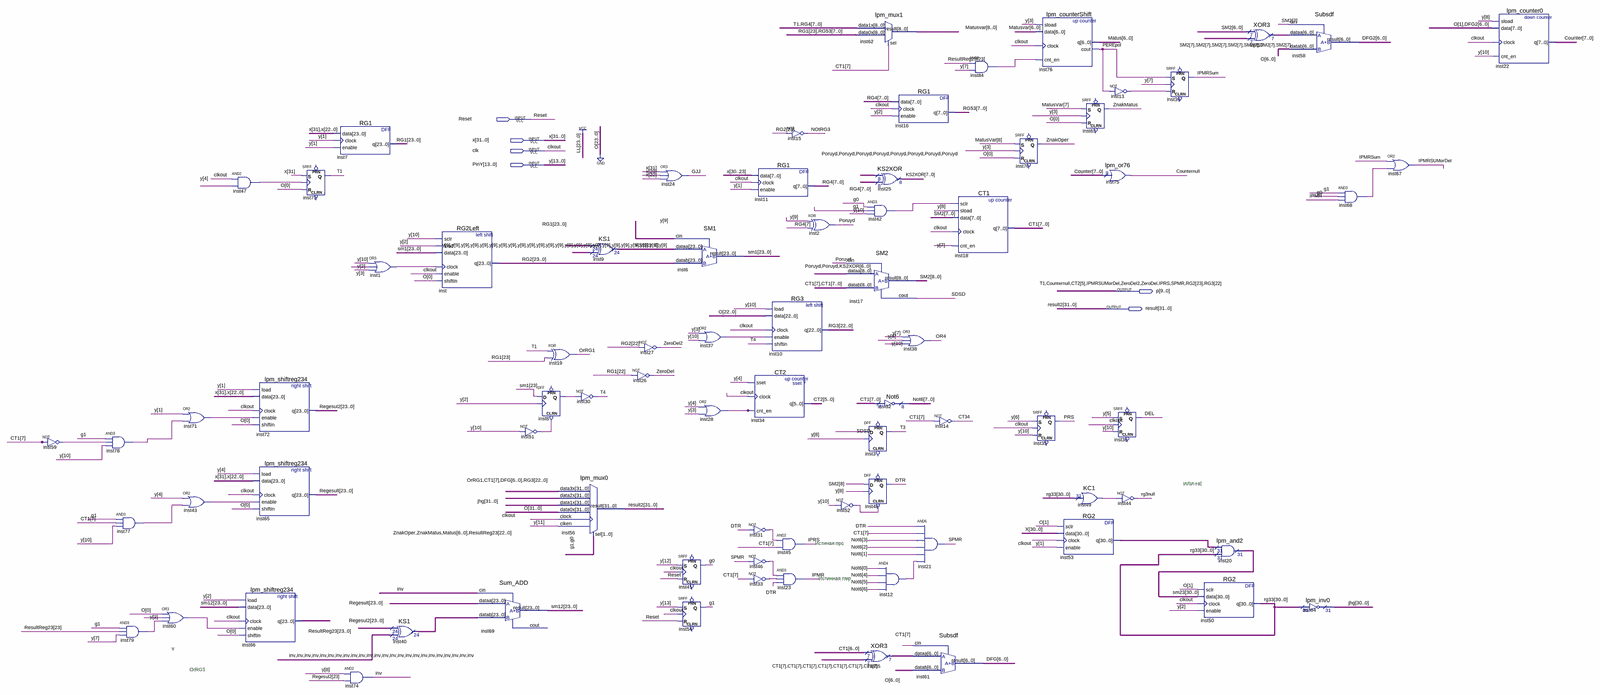
[diagram p0: schematic sheet, whole]
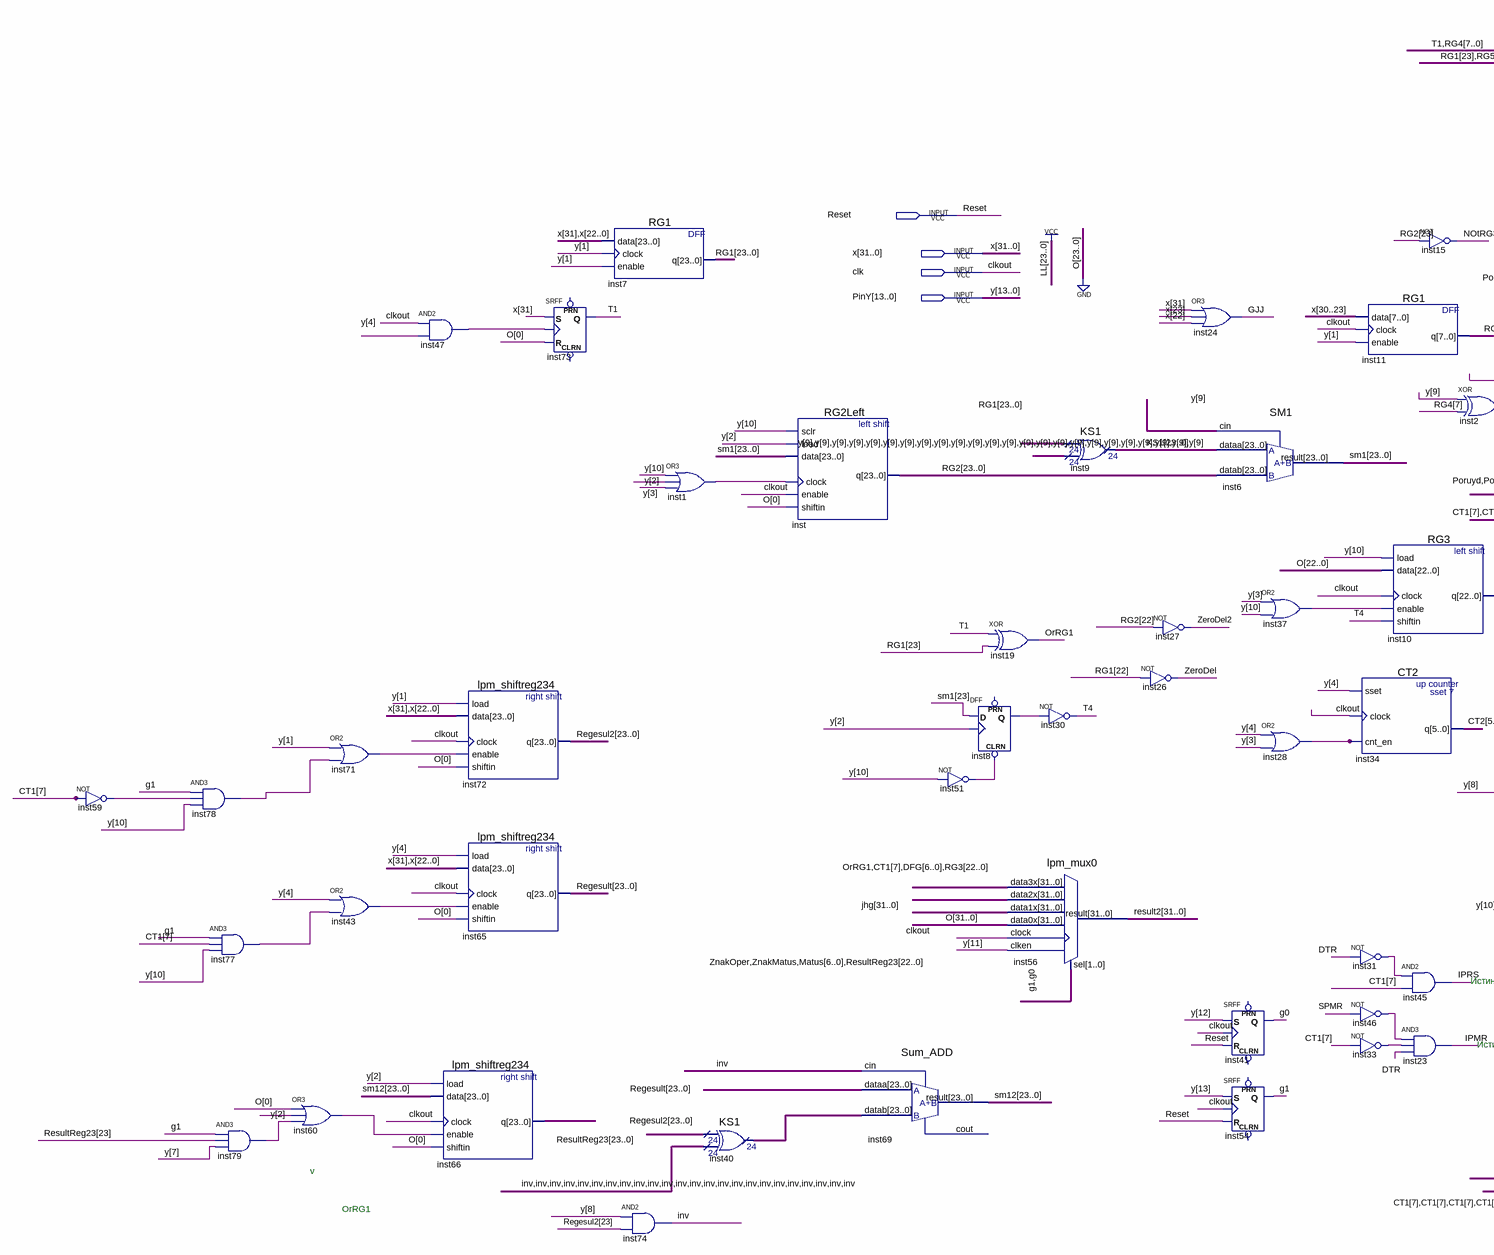
[diagram p1: schematic sheet, left part]
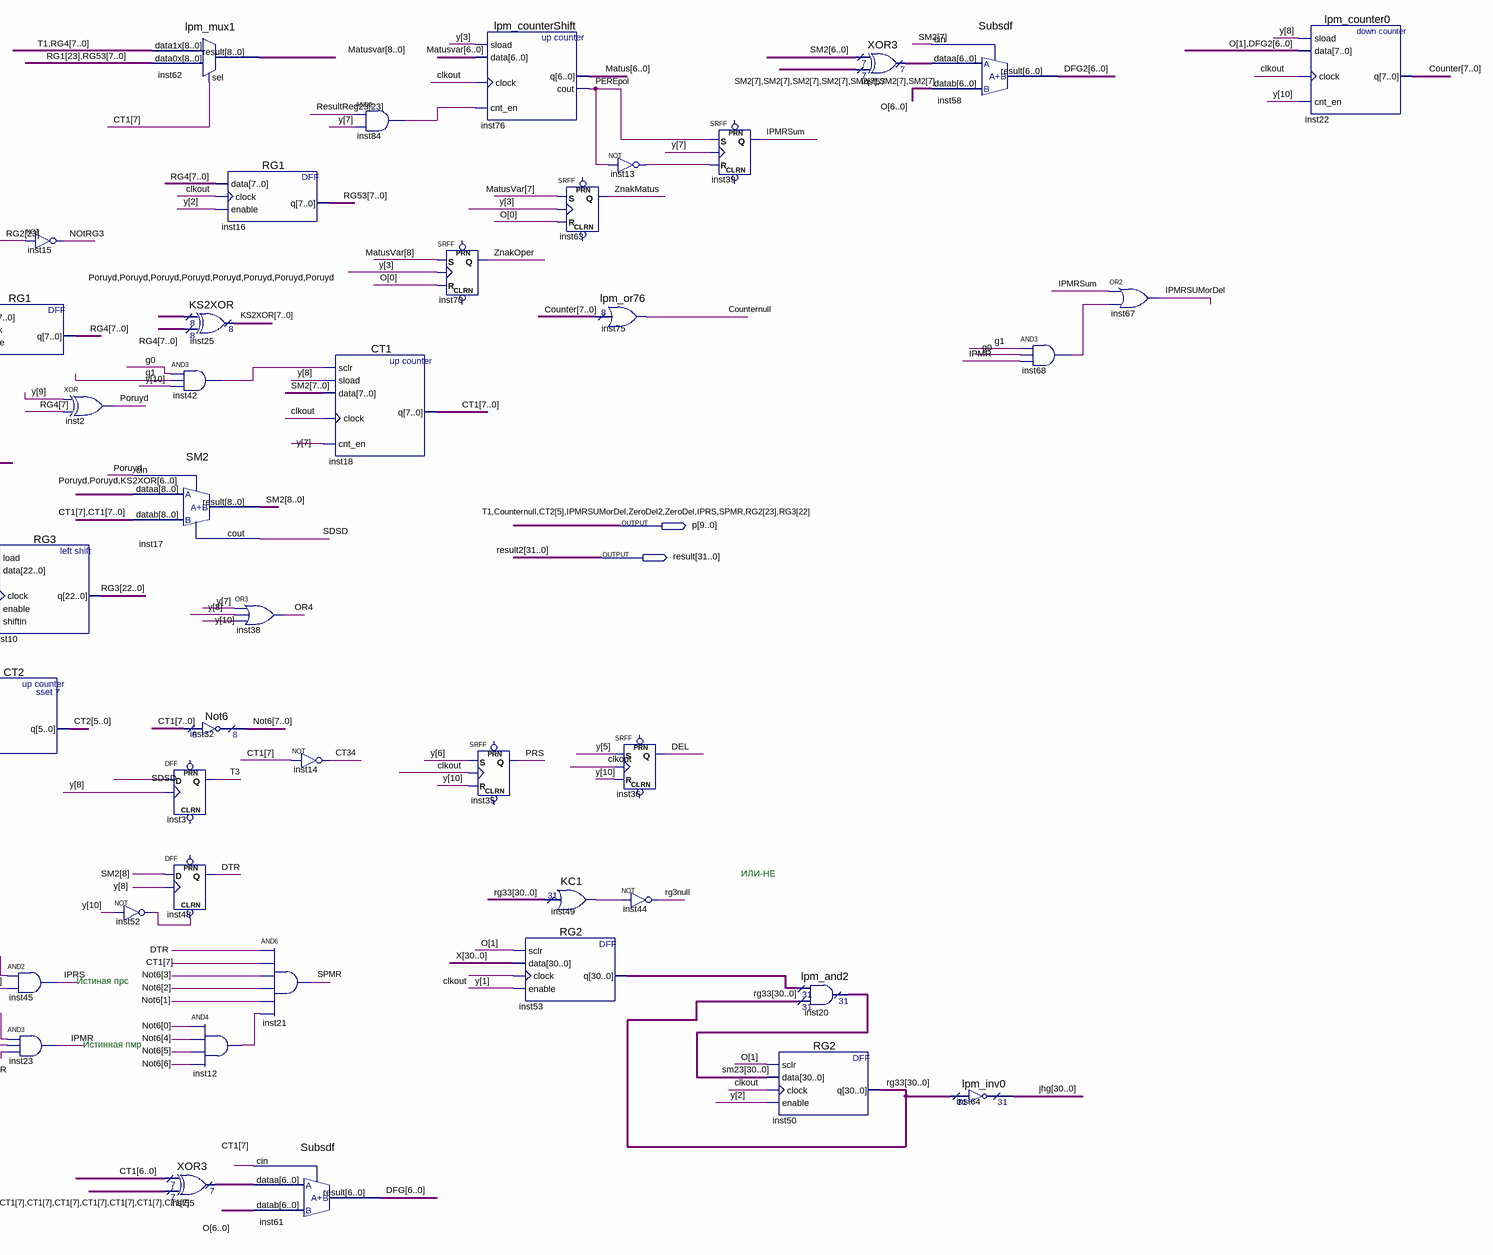
[diagram p2: schematic sheet, right part]
// Quartus schematic courseProject.bdf as structural Verilog: 78 symbols, 6 pins
module courseProject (
  input  Reset,
  input  [31:0] x,
  input  clk,
  input  [13:0] PinY,
  output [9:0] p,
  output [31:0] result
);

  wire CT34, DEL, DTR, g0, g1, GJJ, inst1_out, inst8_q, inst12_out, inst13_out, inst28_out, inst31_out,
       inst33_out, inst37_out, inst42_out, inst43_out, inst46_out, inst47_out, inst49_result, inst51_out,
       inst52_out, inst59_out, inst60_out, inst68_out, inst71_out, inst77_out, inst78_out, inst79_out,
       inst84_out, inv, IPMR, IPMRSum, NOtRG3, OR4, OrRG1, PEREpol, Poruyd, PRS, rg3null, SDSD, T3, T4,
       ZnakMatus, ZnakOper;
  wire [4:0] CT2;
  wire [6:0] DFG, DFG2, inst55_result, inst57_result, Matus;
  wire [7:0] Counter, CT1, KS2XOR, Not6, RG4, RG53;
  wire [8:0] MatusVar, SM2;
  wire [21:0] RG3;
  wire [22:0] RG2;
  wire [23:0] inst40_result, KS1, Regesul2, Regesult, ResultReg23, RG1, sm1, sm12;
  wire [30:0] inst53_q, rg33, sm23;
  wire [31:0] jhg;
  wire [31:24] O;

  not inst59 (inst59_out, CT1[7]);
  and inst78 (inst78_out, g1, inst59_out, PinY[10]);
  and inst77 (inst77_out, g1, CT1[7], PinY[10]);
  and inst79 (inst79_out, g1, ResultReg23[23], PinY[7]);
  or inst71 (inst71_out, PinY[1], inst78_out);
  or inst43 (inst43_out, PinY[4], inst77_out);
  or inst60 (inst60_out, 1'b0, PinY[2], inst79_out);
  and inst47 (inst47_out, clk, PinY[4]);
  lpm_shiftreg234 inst66 (
    .load(PinY[2]), .data(sm12), .clock(clk), .enable(inst60_out), .shiftin(1'b0), .q(ResultReg23));
  lpm_shiftreg234 inst72 (
    .load(PinY[1]), .data({x[31], x[22:0]}), .clock(clk), .enable(inst71_out), .shiftin(1'b0), .q(Regesul2));
  lpm_shiftreg234 inst65 (
    .load(PinY[4]), .data({x[31], x[22:0]}), .clock(clk), .enable(inst43_out), .shiftin(1'b0), .q(Regesult));
  SRFF inst73 (.S(x[31]), .R(1'b0), .CLK(inst47_out), .Q(p[9]));  // open: PRN, CLRN
  RG1 inst7 (.data({x[31], x[22:0]}), .clock(PinY[1]), .enable(PinY[1]), .q(RG1));
  and inst74 (inv, PinY[8], Regesul2[23]);
  or inst1 (inst1_out, PinY[10], PinY[2], PinY[3]);
  KS1 inst40 (.data0x(Regesul2), .data1x({24{inv}}), .result(inst40_result));
  RG2Left inst (
    .sclr(PinY[10]), .load(PinY[2]), .data(sm1), .clock(inst1_out), .enable(clk), .shiftin(1'b0),
    .q({p[1], RG2}));
  Sum_ADD inst69 (.dataa(Regesult), .datab(inst40_result), .cin(inv), .result(sm12));  // open: cout
  not inst51 (inst51_out, PinY[10]);
  xor inst19 (OrRG1, p[9], RG1[23]);
  DFF inst8 (.CLRN(inst51_out), .CLK(PinY[2]), .D(sm1[23]), .Q(inst8_q));  // open: PRN
  not inst30 (T4, inst8_q);
  lpm_mux0 inst56 (
    .data3x({OrRG1, CT1[7], DFG, p[0], RG3}), .data2x({ZnakOper, ZnakMatus, Matus, ResultReg23[22:0]}),
    .data1x(jhg), .data0x({O, {24{1'b0}}}), .clock(clk), .clken(PinY[11]), .sel({g1, g0}), .result(result));
  KS1 inst9 (.data0x(RG1), .data1x({24{PinY[9]}}), .result(KS1));
  not inst26 (p[4], RG1[22]);
  or inst24 (GJJ, x[31], x[23], x[22]);
  not inst27 (p[5], RG2[22]);
  SM1 inst6 (.dataa(KS1), .datab({p[1], RG2}), .cin(PinY[9]), .result(sm1));
  SRFF inst41 (.S(PinY[12]), .R(Reset), .CLK(clk), .Q(g0));  // open: PRN, CLRN
  SRFF inst54 (.S(PinY[13]), .R(Reset), .CLK(clk), .Q(g1));  // open: PRN, CLRN
  or inst37 (inst37_out, PinY[3], PinY[10]);
  or inst28 (inst28_out, PinY[4], PinY[3]);
  RG1 inst11 (.data(x[30:23]), .clock(clk), .enable(PinY[1]), .q(RG4));
  RG3 inst10 (.load(PinY[10]), .data({23{1'b0}}), .clock(clk), .enable(inst37_out), .shiftin(T4), .q({p[0], RG3}));
  CT2 inst34 (.sset(PinY[4]), .clock(clk), .cnt_en(inst28_out), .q({p[7], CT2}));
  not inst31 (inst31_out, DTR);
  not inst46 (inst46_out, p[2]);
  not inst33 (inst33_out, CT1[7]);
  not inst15 (NOtRG3, p[1]);
  and inst45 (p[3], inst31_out, CT1[7]);
  and inst23 (IPMR, inst46_out, inst33_out, DTR);
  xor inst2 (Poruyd, PinY[9], RG4[7]);
  lpm_mux1 inst62 (.data1x({p[9], RG4}), .data0x({RG1[23], RG53}), .sel(CT1[7]), .result(MatusVar));
  SM2 inst17 (
    .dataa({{2{Poruyd}}, KS2XOR[6:0]}), .datab({{2{CT1[7]}}, CT1[6:0]}), .cin(Poruyd), .result(SM2),
    .cout(SDSD));
  not inst52 (inst52_out, PinY[10]);
  KS2XOR inst25 (.data0x({8{Poruyd}}), .data1x(RG4), .result(KS2XOR));
  and inst42 (inst42_out, g0, g1, PinY[10]);
  Not6 inst32 (.data(CT1), .result(Not6));
  DFF inst3 (.CLK(PinY[8]), .D(SDSD), .Q(T3));  // open: CLRN, PRN
  DFF inst48 (.CLRN(inst52_out), .CLK(PinY[8]), .D(SM2[8]), .Q(DTR));  // open: PRN
  and inst12 (inst12_out, Not6[0], Not6[4], Not6[5], Not6[6]);
  XOR3 inst55 (.data0x(CT1[6:0]), .data1x({7{CT1[7]}}), .result(inst55_result));
  RG1 inst16 (.data(RG4), .clock(clk), .enable(PinY[2]), .q(RG53));
  or inst38 (OR4, PinY[7], PinY[8], PinY[10]);
  Subsdf inst61 (.dataa(inst55_result), .datab({7{1'b0}}), .cin(CT1[7]), .result(DFG));
  not inst14 (CT34, CT1[7]);
  and inst21 (p[2], DTR, CT1[7], Not6[3], Not6[2], Not6[1], inst12_out);
  and inst84 (inst84_out, ResultReg23[23], PinY[7]);
  CT1 inst18 (.sclr(inst42_out), .sload(PinY[8]), .data(SM2[7:0]), .clock(clk), .cnt_en(PinY[7]), .q(CT1));
  SRFF inst70 (.S(MatusVar[8]), .R(1'b0), .CLK(PinY[3]), .Q(ZnakOper));  // open: PRN, CLRN
  lpm_counterShift inst76 (
    .sload(PinY[3]), .data(MatusVar[6:0]), .clock(clk), .cnt_en(inst84_out), .q(Matus), .cout(PEREpol));
  SRFF inst35 (.S(PinY[6]), .R(PinY[10]), .CLK(clk), .Q(PRS));  // open: PRN, CLRN
  SRFF inst63 (.S(MatusVar[7]), .R(1'b0), .CLK(PinY[3]), .Q(ZnakMatus));  // open: PRN, CLRN
  KC1 inst49 (.data(rg33), .result(inst49_result));
  RG2 inst53 (.sclr(1'b0), .data(x[30:0]), .clock(clk), .enable(PinY[1]), .q(inst53_q));
  not inst13 (inst13_out, PEREpol);
  lpm_or76 inst75 (.data(Counter), .result(p[8]));
  SRFF inst36 (.S(PinY[5]), .R(PinY[10]), .CLK(clk), .Q(DEL));  // open: PRN, CLRN
  not inst44 (rg3null, inst49_result);
  SRFF inst39 (.S(PEREpol), .R(inst13_out), .CLK(PinY[7]), .Q(IPMRSum));  // open: PRN, CLRN
  lpm_and2 inst20 (.data0x(inst53_q), .data1x(rg33), .result(sm23));
  RG2 inst50 (.sclr(1'b0), .data(sm23), .clock(clk), .enable(PinY[2]), .q(rg33));
  XOR3 inst57 (.data0x(SM2[6:0]), .data1x({7{SM2[7]}}), .result(inst57_result));
  Subsdf inst58 (.dataa(inst57_result), .datab({7{1'b0}}), .cin(SM2[7]), .result(DFG2));
  lpm_inv0 inst64 (.data(rg33), .result(jhg[30:0]));
  and inst68 (inst68_out, g1, g0, IPMR);
  or inst67 (p[6], IPMRSum, inst68_out);
  lpm_counter0 inst22 (.sload(PinY[8]), .data({1'b0, DFG2}), .clock(clk), .cnt_en(PinY[10]), .q(Counter));

  // Other names for the same wires on the sheet: clkout = clk; Counternull = p[8]; CT2[5] = p[7]; IPMRSUMorDel = p[6];
  //   IPRS = p[3]; result2[31:0] = result; RG2[23] = p[1]; RG3[22] = p[0]; SPMR = p[2]; T1 = p[9]; y[13:0] = PinY;
  //   ZeroDel = p[4]; ZeroDel2 = p[5]

  // Notes on the sheet:
  //   ИЛИ-НЕ
  //   Истиная прс
  //   Истинная пмр
  //   v
  //   OrRG1
endmodule
